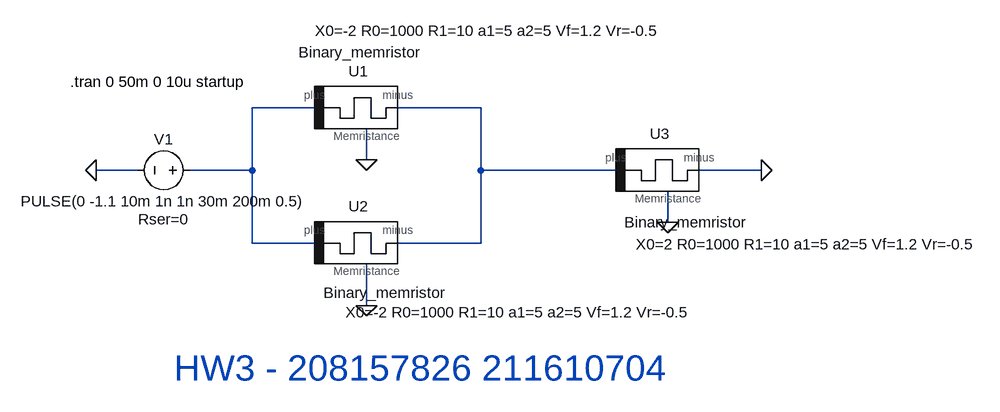
[diagram p0: schematic Q2.asc]
Q2.asc, the LTspice schematic file:
Version 4
SHEET 1 1260 680
WIRE 160 160 64 160
WIRE 416 160 288 160
WIRE 240 240 240 192
WIRE -112 256 -176 256
WIRE 64 256 64 160
WIRE 64 256 -32 256
WIRE 416 256 416 160
WIRE 624 256 416 256
WIRE 848 256 752 256
WIRE 704 336 704 288
WIRE 64 368 64 256
WIRE 160 368 64 368
WIRE 416 368 416 256
WIRE 416 368 288 368
WIRE 240 464 240 400
FLAG -176 256 0
FLAG 848 256 0
FLAG 240 240 0
FLAG 240 464 0
FLAG 704 336 0
SYMBOL Binary 240 160 R0
WINDOW 3 -10 -101 Top 2
WINDOW 39 189 -134 Top 2
SYMATTR SpiceLine X0=-2 R0=1000 R1=10 a1=5 a2=5 Vf=1.2 Vr=-0.5
SYMATTR InstName U1
SYMBOL Binary 240 368 R0
WINDOW 3 29 61 Top 2
WINDOW 39 236 91 Top 2
SYMATTR SpiceLine X0=-2 R0=1000 R1=10 a1=5 a2=5 Vf=1.2 Vr=-0.5
SYMATTR InstName U2
SYMBOL Binary 704 256 R0
WINDOW 3 28 64 Top 2
WINDOW 39 215 98 Top 2
SYMATTR SpiceLine X0=2 R0=1000 R1=10 a1=5 a2=5 Vf=1.2 Vr=-0.5
SYMATTR InstName U3
SYMBOL voltage -16 256 R90
WINDOW 0 -32 56 VBottom 2
WINDOW 3 32 56 VTop 2
WINDOW 123 0 0 Left 0
WINDOW 39 60 56 VTop 2
SYMATTR InstName V1
SYMATTR Value PULSE(0 -1.1 10m 1n 1n 30m 200m 0.5)
SYMATTR SpiceLine Rser=0
TEXT -56 560 Left 5 ;HW3 - 208157826 211610704
TEXT -216 120 Left 2 !.tran 0 50m 0 10u startup

The netlist it stands for:
* Q2.asc
XU1 N001 N002 0 Binary_memristor X0=-2 R0=1000 R1=10 a1=5 a2=5 Vf=1.2 Vr=-0.5  ; pins plus minus Memristance
XU2 N001 N002 0 Binary_memristor X0=-2 R0=1000 R1=10 a1=5 a2=5 Vf=1.2 Vr=-0.5  ; pins plus minus Memristance
XU3 N002 0 0 Binary_memristor X0=2 R0=1000 R1=10 a1=5 a2=5 Vf=1.2 Vr=-0.5  ; pins plus minus Memristance
V1 N001 0 PULSE(0 -1.1 10m 1n 1n 30m 200m 0.5) Rser=0
* HW3 - 208157826 211610704
.tran 0 50m 0 10u startup
.lib Binary.lib
.backanno
.end